# EAGLE design VretenarServoLegacyShield (EAGLE 9.6.2)
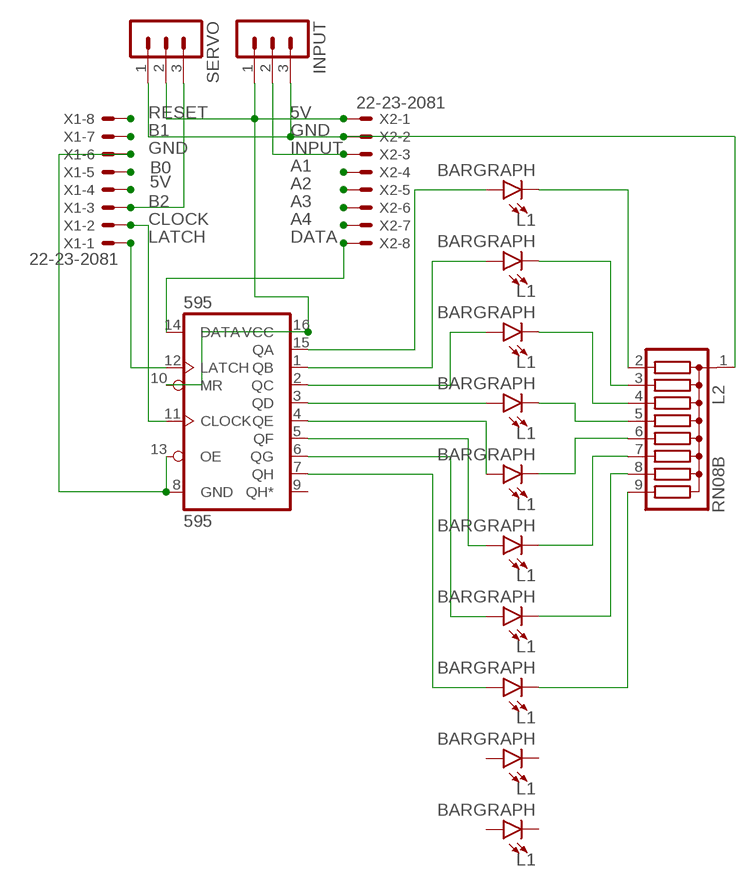
[diagram p0: schematic, sheet 1]

## Parts
595  595  [DIL16]
INPUT  MA03-1  [MA03-1]
L1  BARGRAPH  [LB10]
L2  RN08B  [RN-9]
SERVO  MA03-1  [MA03-1]
X1  22-23-2081  [22-23-2081]
X2  22-23-2081  [22-23-2081]

## Nets
5V: 595.10(MR) 595.16(VCC) INPUT.1 SERVO.2 X1.4 X2.1
A1: X2.4
A2: X2.5
A3: X2.6
A4: X2.7
B0: X1.5
B1: X1.7
B2: SERVO.3 X1.3
CLOCK: 595.11(CLOCK) X1.2
DATA: 595.14(DATA) X2.8
GND: 595.8(GND) 595.13(OE) INPUT.3 L2.1 SERVO.1 X1.6 X2.2
INPUT: INPUT.2 X2.3
LATCH: 595.12(LATCH) X1.1
N$1: 595.15(QA) L1.1(A9)
N$2: 595.1(QB) L1.2(A8)
N$3: 595.2(QC) L1.3(A7)
N$4: 595.3(QD) L1.4(A6)
N$5: 595.4(QE) L1.5(A5)
N$6: 595.5(QF) L1.6(A4)
N$7: 595.6(QG) L1.7(A3)
N$8: 595.7(QH) L1.8(A2)
N$9: L1.20(C9) L2.2
N$10: L1.19(C8) L2.3
N$11: L1.18(C7) L2.4
N$12: L1.17(C6) L2.5
N$13: L1.16(C5) L2.6
N$14: L1.15(C4) L2.7
N$15: L1.14(C3) L2.8
N$16: L1.13(C2) L2.9
RESET: X1.8
Unconnected: 595.9(QH*) L1.9(A1) L1.10(A) L1.11(C) L1.12(C1)

## Library data of the parts
595 = ACES_THT:595: If required, place a PWM signal on the G (/OE) pin 13 for fading (breathing) effects.
INPUT SERVO = con-lstb:MA03-1: PIN HEADER; OC_FARNELL: unknown; OC_NEWARK: unknown
L1 = ACES_THT:BARGRAPH: Digikey Part #'s: 1080-1183-ND (Green) <https://www.digikey.ca/product-detail/en/everlight-electronics-co-ltd/MV54164/1080-1183-ND/2675674> 160-1066-ND (Red) <https://www.digikey.ca/product-detail/en/lite-on-inc/LTA-1000HR/160-1066-ND/153273> 160-1068-ND (Yellow) <https://www.digikey.ca/product-detail/en/lite-on-inc/LTA-1000Y/160-1068-ND/153283> 1497-1079-5-ND (Blue) <https://www.digikey.ca/products/en/optoelectronics/leds-circuit-board-indicators-arrays-light-bars-bar-graphs/106?k=&pkeyword=&sv=1&pv1989=0&pv37=1671&sf=0&FV=ffe0006a&quantity=&ColumnSort=0&page=1&stock=1&pageSize=25>* * pricey! Last Ordered: 2019 02 28
L2 = ACES_THT:RN08B: RESISTOR NETWORK: BUSSED: 8 positions suitable for binary byte display on a bargraph
X1 X2 = con-molex:22-23-2081: .100" (2.54mm) Center Header - 8 Pin; MF: MOLEX; MPN: 22-23-2081; OC_FARNELL: 1756826; OC_NEWARK: 01C7592

## Board
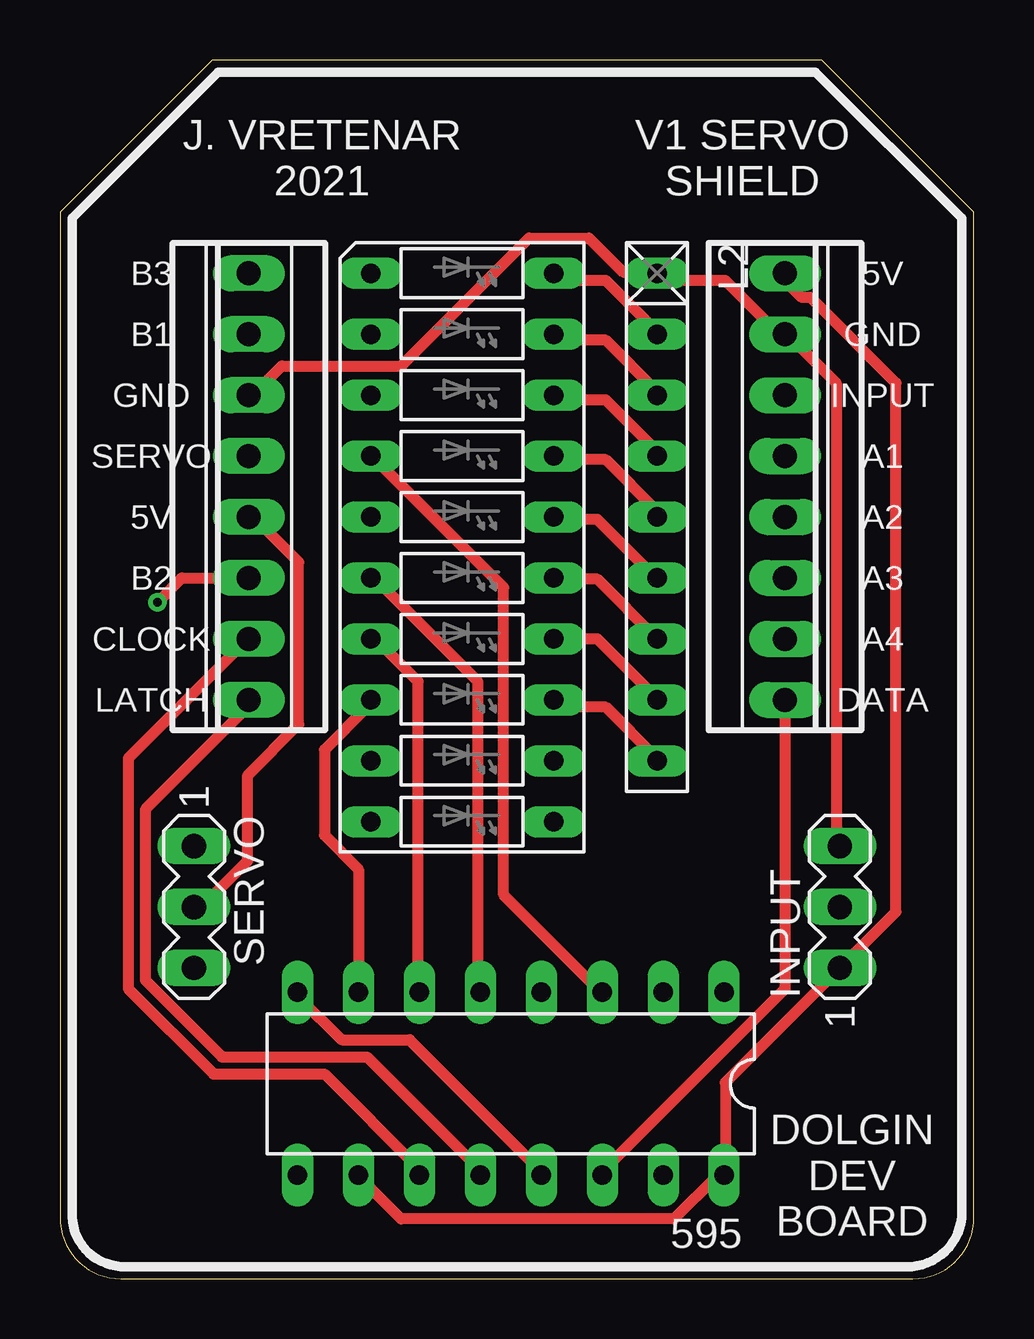
[diagram p1: board, top side]
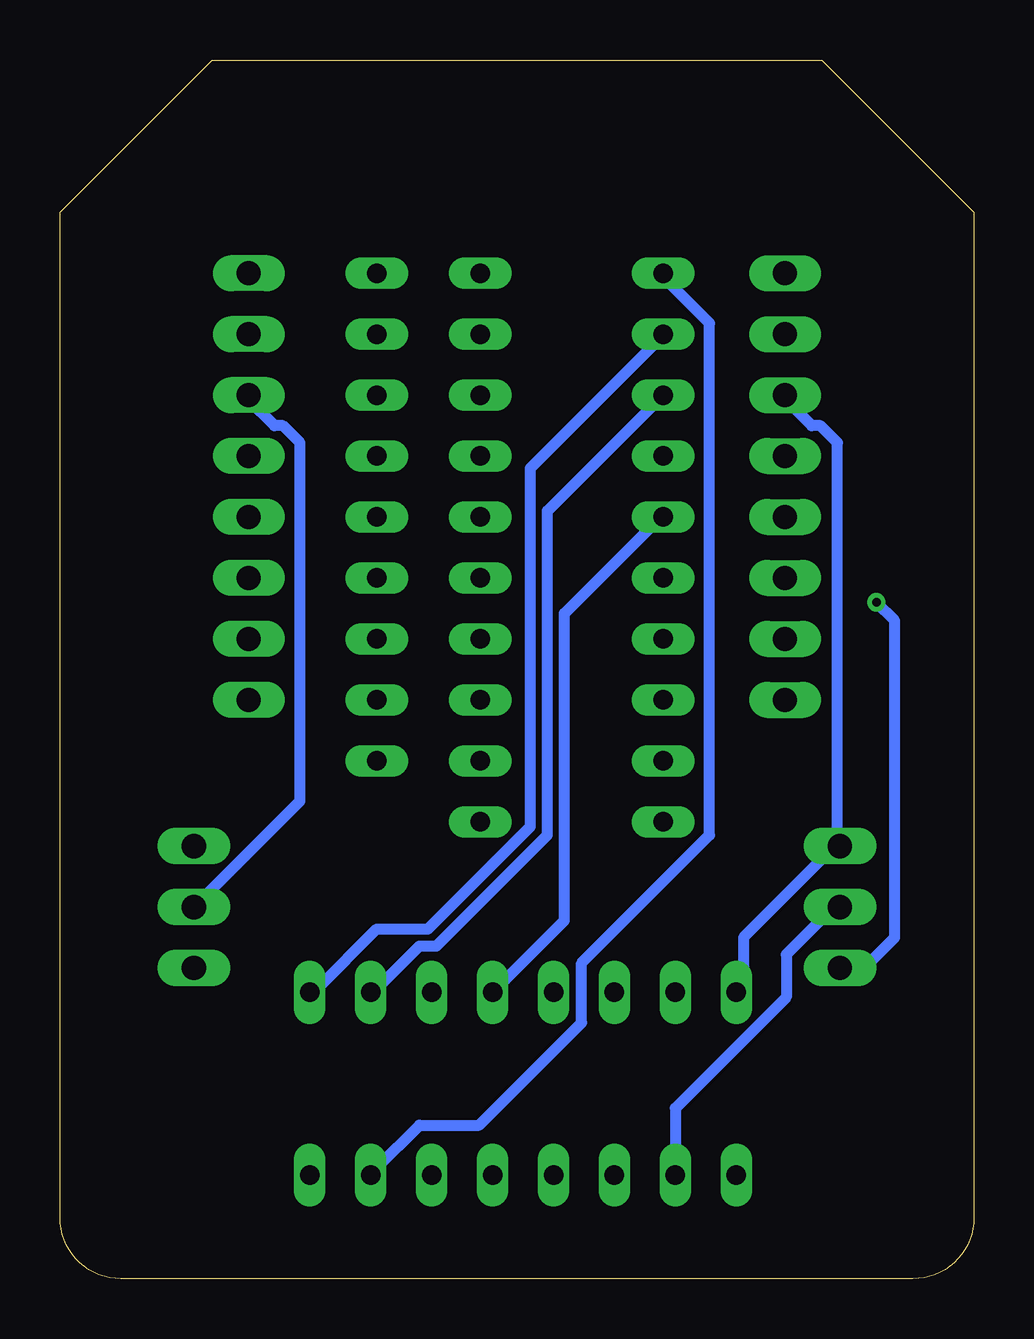
[diagram p2: board, bottom side, seen from below]

Size 38.1 x 50.8 mm. Coordinates in mm from the lower left corner, seen from the top.
Outline: 0,44.45 0,2.54 arc90 2.54,0 35.56,0 arc90 38.1,2.54 38.1,44.45 31.75,50.8 6.35,50.8 0,44.45
Copper layers (1*16): Top 0.035mm / dielectric 1.5mm / Bottom 0.035mm
Design rules "ACES_THT": minimum track width 18mil, minimum drill 0.35mm, track to track 10mil, track to pad 10mil, pad to pad 10mil, via to via 10mil, smd to smd 6mil, copper to edge 40mil, drill to drill 6mil, minimum pad ring 10mil, minimum via ring 8mil, stop-mask expansion 4mil, vias tented up to drill 0mil, thermal gap 10mil

### Footprints (pad centres in the part's own frame; a part is rotated, then mirrored left to right if it is on the bottom)
DIL16 = drill 0.813 long: 1 -8.89,-3.81; 2 -6.35,-3.81; 3 -3.81,-3.81; 4 -1.27,-3.81; 5 1.27,-3.81; 6 3.81,-3.81; 7 6.35,-3.81; 8 8.89,-3.81; 9 8.89,3.81; 10 6.35,3.81; 11 3.81,3.81; 12 1.27,3.81; 13 -1.27,3.81; 14 -3.81,3.81; 15 -6.35,3.81; 16 -8.89,3.81
MA03-1 = drill 1.016 long: 1 -2.54,0; 2 0,0; 3 2.54,0
LB10 = drill 0.813 long: 1 -11.43,-3.81; 2 -8.89,-3.81; 3 -6.35,-3.81; 4 -3.81,-3.81; 5 -1.27,-3.81; 6 1.27,-3.81; 7 3.81,-3.81; 8 6.35,-3.81; 9 8.89,-3.81; 10 11.43,-3.81; 11 11.43,3.81; 12 8.89,3.81; 13 6.35,3.81; 14 3.81,3.81; 15 1.27,3.81; 16 -1.27,3.81; 17 -3.81,3.81; 18 -6.35,3.81; 19 -8.89,3.81; 20 -11.43,3.81
RN-9 = drill 0.813 long: 1 -10.16,0; 2 -7.62,0; 3 -5.08,0; 4 -2.54,0; 5 0,0; 6 2.54,0; 7 5.08,0; 8 7.62,0; 9 10.16,0
22-23-2081 = drill 1 long: 1 -8.89,0; 2 -6.35,0; 3 -3.81,0; 4 -1.27,0; 5 1.27,0; 6 3.81,0; 7 6.35,0; 8 8.89,0

### Placement (x,y rotation side)
595  18.8,8.13 180 top
INPUT  32.51,15.49 90 top
L1  16.76,30.48 270 top
L2  24.89,31.75 270 top
SERVO  5.59,15.49 270 top
U$9  [ACES_LOGO_MEDIUM]  4.83,6.35 0 top
X1  7.87,33.02 90 top
X2  30.23,33.02 270 top

### Tracks (layer width: path | path; a pad name or v marks a point on that pad's centre or on a via)
5V
  Top 0.457: X1.4 8.18,31.65 9.96,29.87 9.96,23.11 7.82,20.98 7.82,17.42 5.69,15.29 SERVO.2 | X2.1 30.23,41.6 30.94,40.89 31.29,40.89 34.85,37.34 34.85,15.29 INPUT.1 27.74,8.18 27.74,4.62 595.16 27.38,4.27 25.6,2.49 14.22,2.49 12.45,4.27 595.10
  Bottom 0.457: 595.10 12.45,7.11 7.82,11.73 7.82,13.51 5.69,15.65 SERVO.2
B2  (via drill 0.35)
  Top 0.457: v4.06,28.19 5.08,29.21 X1.3
  Bottom 0.457: SERVO.3 4.57,12.95 3.3,14.22 3.3,27.43 v4.06,28.19
CLOCK
  Top 0.457: 595.11 14.94,4.62 11.02,8.53 6.4,8.53 2.85,12.09 2.85,21.69 7.82,26.67 X1.2
DATA
  Top 0.457: X2.8 30.23,12.09 22.76,4.62 595.14
GND
  Top 0.457: INPUT.3 32.36,18.14 32.36,37.34 30.23,39.47 X2.2 30.23,39.12 27.74,41.6 24.89,41.6 L2.1 24.89,41.96 23.47,41.96 22.05,43.38 19.56,43.38 14.22,38.05 9.25,38.05 8.18,36.98 X1.6 | 595.13 19.91,4.62 14.58,9.96 11.73,9.96 9.96,11.73 595.8
  Bottom 0.457: 5.69,18.14 9.6,14.22 9.6,12.09 595.8 | 5.69,18.14 5.69,34.85 6.4,35.56 6.76,35.56 7.82,36.63 X1.6 | 5.69,18.14 SERVO.1
INPUT
  Bottom 0.457: INPUT.2 28.09,19.91 28.09,34.85 28.8,35.56 29.16,35.56 30.23,36.63 X2.3
LATCH
  Top 0.457: 595.12 17.42,4.62 12.8,9.25 6.76,9.25 3.56,12.45 3.56,19.56 7.82,23.82 X1.1
N$1
  Bottom 0.457: L1.1 12.8,41.6 11.02,39.83 11.02,18.49 16.36,13.16 16.36,10.67 20.62,6.4 23.11,6.4 24.89,4.62 595.15
N$2
  Bottom 0.457: L1.2 13.16,39.12 18.49,33.78 18.49,18.85 22.76,14.58 24.89,14.58 27.38,12.09 595.1
N$3
  Bottom 0.457: L1.3 17.78,32 17.78,18.49 22.4,13.87 23.11,13.87 24.89,12.09 595.2
N$4
  Top 0.457: L1.4 13.16,34.14 18.49,28.8 18.49,16 22.4,12.09 595.3
N$5
  Bottom 0.457: 595.4 17.07,14.94 17.07,27.74 13.16,31.65 L1.5
N$6
  Top 0.457: L1.6 13.16,29.16 17.42,24.89 17.42,12.09 595.5
N$7
  Top 0.457: L1.7 13.16,26.67 14.94,24.89 14.94,12.09 595.6
N$8
  Top 0.457: 595.7 12.45,17.07 11.02,18.49 11.02,22.05 12.8,23.82 L1.8
N$9
  Top 0.457: L1.20 20.62,41.6 22.76,41.6 24.89,39.47 L2.2
N$10
  Top 0.457: L1.19 20.62,39.12 22.76,39.12 24.89,36.98 L2.3
N$11
  Top 0.457: L1.18 20.62,36.63 22.76,36.63 24.89,34.49 L2.4
N$12
  Top 0.457: L1.17 20.62,34.14 22.76,34.14 24.89,32 L2.5
N$13
  Top 0.457: L1.16 20.62,31.65 22.4,31.65 24.89,29.16 L2.6
N$14
  Top 0.457: L2.7 22.4,29.16 20.62,29.16 L1.15
N$15
  Top 0.457: L1.14 22.4,26.67 24.89,24.18 L2.8
N$16
  Top 0.457: L1.13 20.62,23.82 22.76,23.82 24.89,21.69 L2.9

### Text on the board
_tsilk: J. VRETENAR / 2021 | V1 SERVO / SHIELD | B3 | 5V | B1 | GND | GND | INPUT | SERVO | A1 | 5V | A2 | B2 | A3 | CLOCK | A4 | LATCH | DATA | DOLGIN / DEV / BOARD